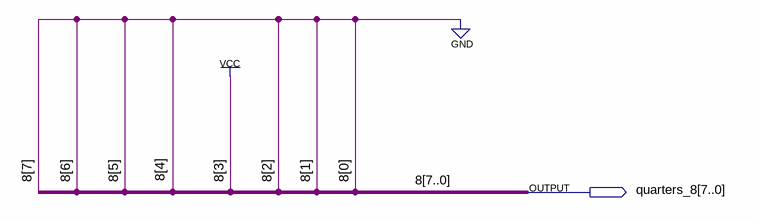
[diagram p0: schematic sheet]
// Quartus schematic quarters_8.bdf as structural Verilog: 0 symbols, 1 pins
module quarters_8 (
  output [7:0] quarters_8
);


  assign quarters_8 = 8'b00001000;
endmodule
